# Altium schematic sheet Nano pi.SchDoc
size A3; SheetNumber: 3; SheetTotal: 6
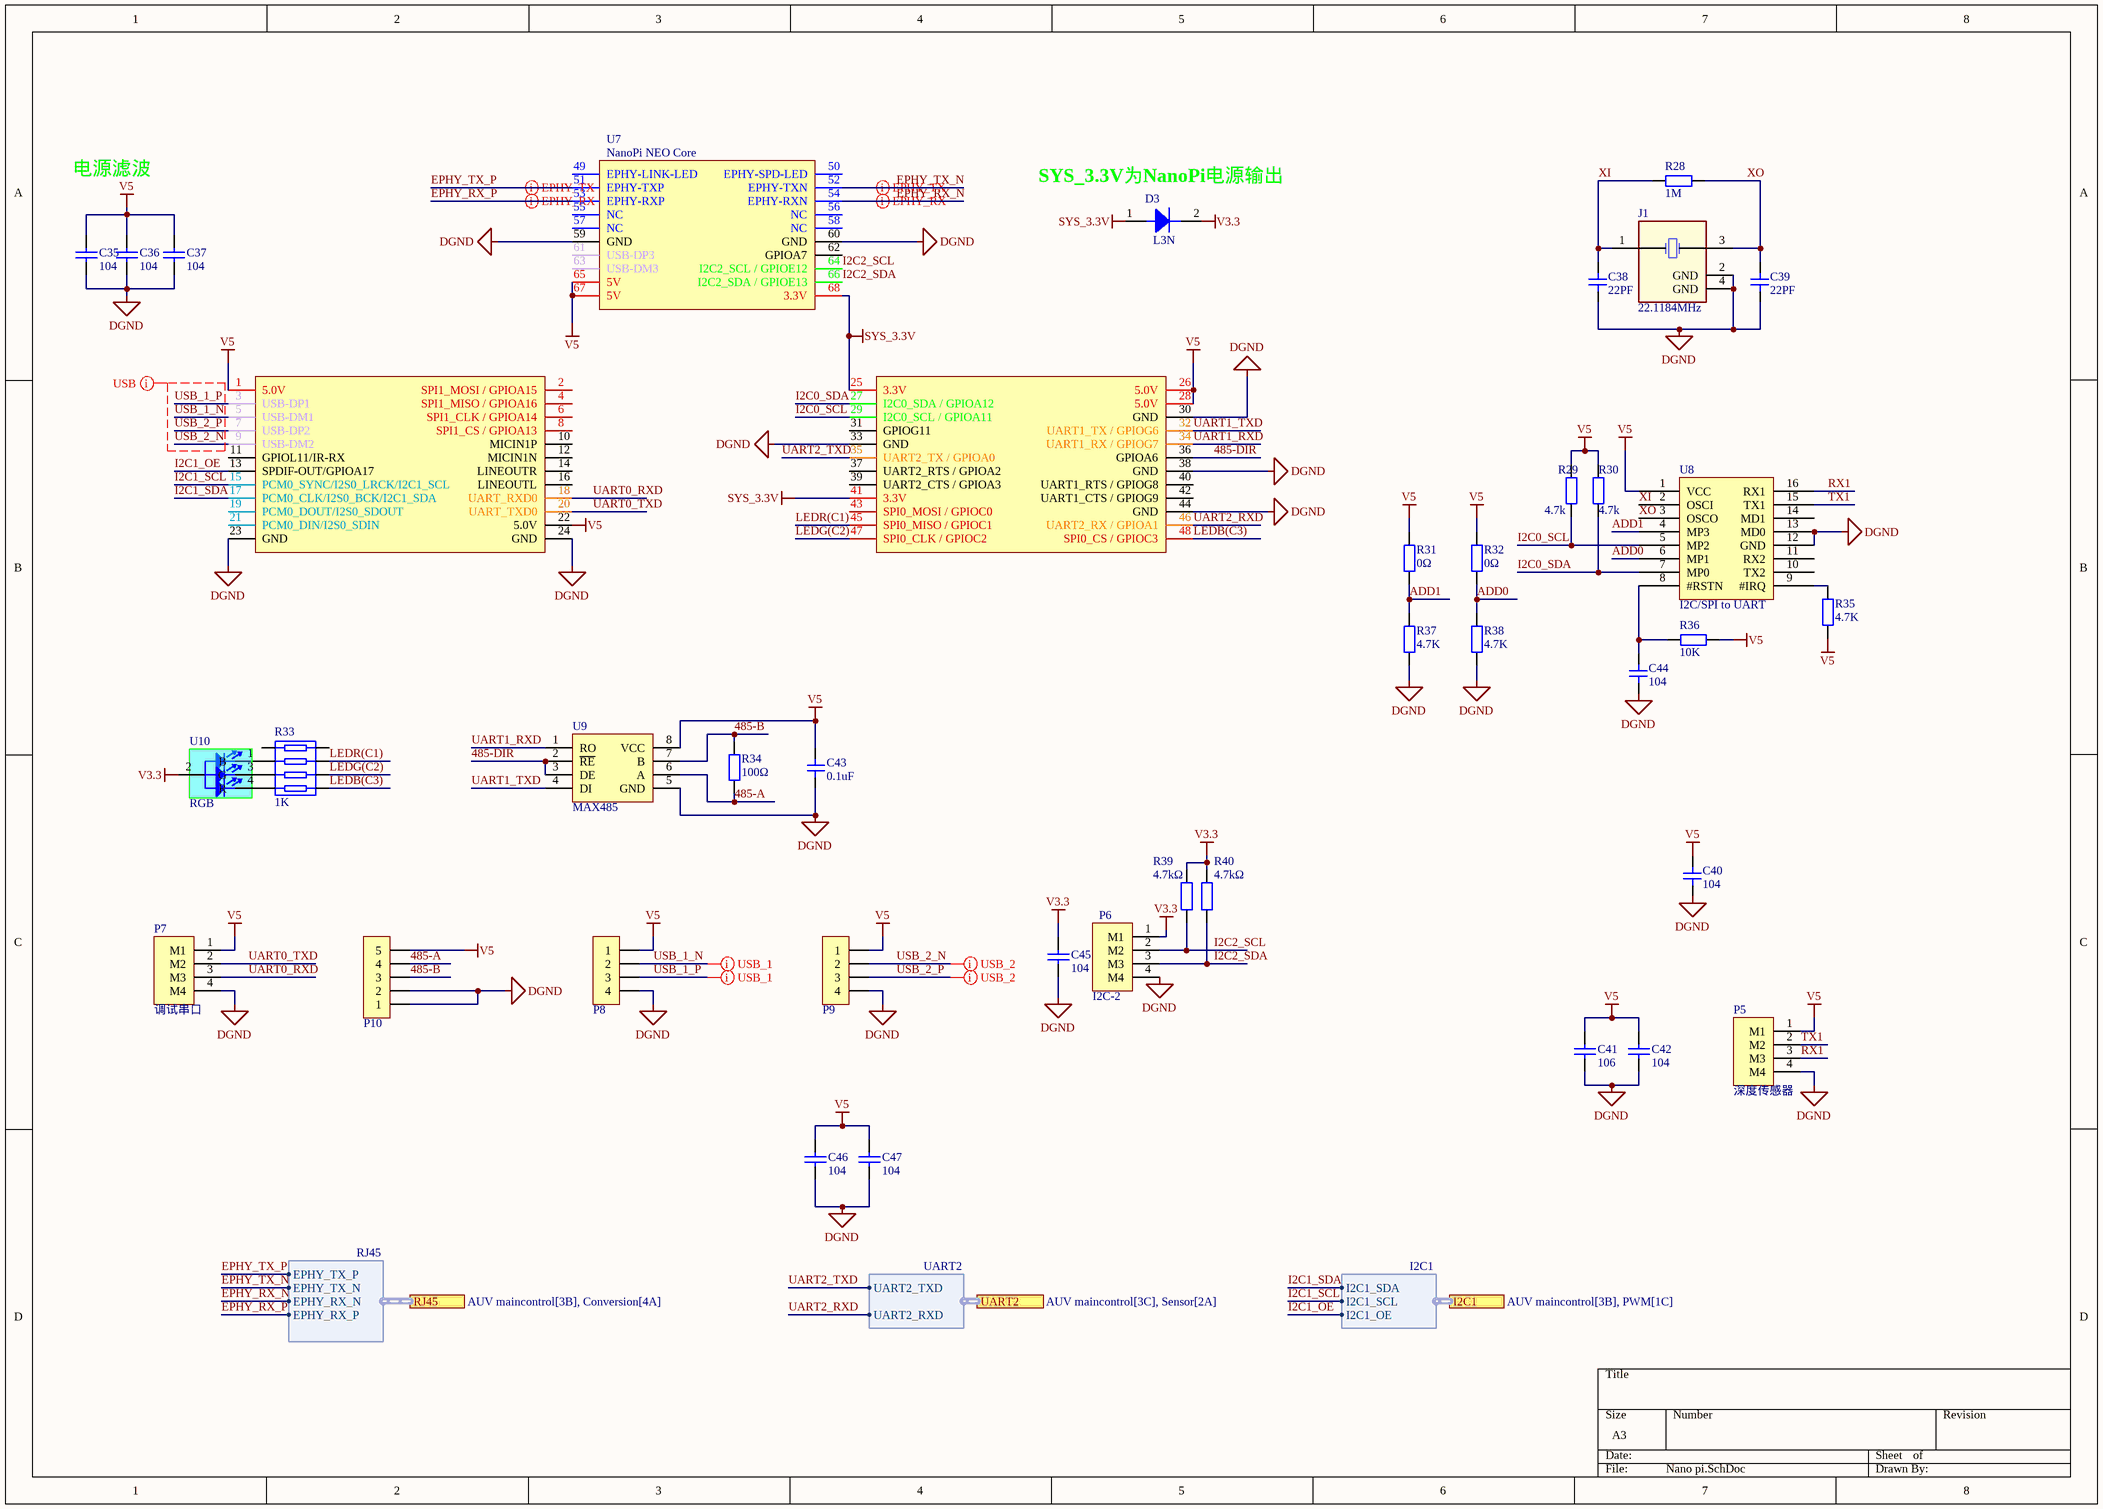
[diagram p0: Nano pi.SchDoc]

## Parts
C35  104  [0603_C]
C36  104  [0603_C]
C37  104  [0603_C]
C38  22PF  [0603_C]
C39  22PF  [0603_C]
C40  104  [0603_C]
C41  106  [0603_C]
C42  104  [0603_C]
C43  0.1uF  [0603_C]
C44  104  [0603_C]
C45  104  [0603_C]
C46  104  [0603_C]
C47  104  [0603_C]
D3  L3N  [SOD-123]
J1  22.1184MHz  [SMD-3225_4P]
P5  深度传感器  [MX1.25S-4P]
P6  I2C-2  [MX1.25S-4P]
P7  调试串口  [MX1.25S-4P]
P8  HDR-1X4  [PH2.0-LS-4P]  (value not drawn)
P9  HDR-1X4  [PH2.0-LS-4P]  (value not drawn)
P10  HDR-1X5  [PH2.0-LS-5P]  (value not drawn)
R28  1M  [0603R]
R29  4.7k  [0603R]
R30  4.7k  [0603R]
R31  0Ω  [0603R]
R32  0Ω  [0603R]
R33  1K  [res-4]
R34  100Ω  [0603R]
R35  4.7K  [0603R]
R36  10K  [0603R]
R37  4.7K  [0603R]
R38  4.7K  [0603R]
R39  4.7kΩ  [0603_R]
R40  4.7kΩ  [0603_R]
U7  NanoPi NEO Core  [NanoPi NEO Core(无引脚名)]
U8  I2C/SPI to UART  [SOP65P780X195-16N]
U9  MAX485  [SOP-8]
U10  RGB  [RGB-3528]

## Ports
I2C1 (harness I2C1, see AUV maincontrol[3B], PWM[1C]), RJ45 (harness RJ45, see AUV maincontrol[3B], Conversion[4A]), UART2 (harness UART2, see AUV maincontrol[3C], Sensor[2A])

## Harnesses
RJ45: EPHY_TX_P, EPHY_TX_N, EPHY_RX_N, EPHY_RX_P
UART2: UART2_TXD, UART2_RXD
I2C1: I2C1_SDA, I2C1_SCL, I2C1_OE

## Nets
DGND: C35.1 C36.1 C37.1 C38.2 C39.2 C40.2 C41.1 C42.1 C43.1 C44.2 C45.1 C46.1 C47.1 J1.2(GND) J1.4(GND) P5.4(M4) P6.4(M4) P7.4(M4) P8.4 P9.4 P10.1 P10.2 R37.1 R38.1 U7.23(GND) U7.24(GND) U7.30(GND) U7.33(GND) U7.38(GND) U7.44(GND) U7.59(GND) U7.60(GND) U8.12(GND) U8.13(MD0) U9.5(GND)
SYS_3.3V: D3.1 U7.25(3.3V) U7.41(3.3V) U7.68(3.3V)
V3.3: C45.2 D3.2 P6.1(M1) R39.2 R40.2 U10.2
V5: C35.2 C36.2 C37.2 C40.1 C41.2 C42.2 C43.2 C46.2 C47.2 P5.1(M1) P7.1(M1) P8.1 P9.1 P10.5 R29.2 R30.2 R31.2 R32.2 R35.1 R36.2 U7.1(5.0V) U7.22(5.0V) U7.26(5.0V) U7.28(5.0V) U7.65(5V) U7.67(5V) U8.1(VCC) U9.8(VCC)
485-A: P10.4 R34.1 U9.6(A)
485-B: P10.3 R34.2 U9.7(B)
485-DIR: U7.36(GPIOA6) U9.2(~{RE}) U9.3(DE)
ADD0: R32.1 R38.2 U8.6(MP1)
ADD1: R31.1 R37.2 U8.4(MP3)
EPHY_RX_N: U7.54(EPHY-RXN) ; port RJ45.EPHY_RX_N
EPHY_RX_P: U7.53(EPHY-RXP) ; port RJ45.EPHY_RX_P
EPHY_TX_N: U7.52(EPHY-TXN) ; port RJ45.EPHY_TX_N
EPHY_TX_P: U7.51(EPHY-TXP) ; port RJ45.EPHY_TX_P
I2C0_SCL: R29.1 U7.29(I2C0_SCL_/_GPIOA11) U8.5(MP2)
I2C0_SDA: R30.1 U7.27(I2C0_SDA_/_GPIOA12) U8.7(MP0)
I2C1_OE: U7.13(SPDIF-OUT/GPIOA17) ; port I2C1.I2C1_OE
I2C1_SCL: U7.15(PCM0_SYNC/I2S0_LRCK/I2C1_SCL) ; port I2C1.I2C1_SCL
I2C1_SDA: U7.17(PCM0_CLK/I2S0_BCK/I2C1_SDA) ; port I2C1.I2C1_SDA
I2C2_SCL: P6.2(M2) R39.1 U7.64(I2C2_SCL_/_GPIOE12)
I2C2_SDA: P6.3(M3) R40.1 U7.66(I2C2_SDA_/_GPIOE13)
LEDB(C3): R33.5 U7.48(SPI0_CS_/_GPIOC3)
LEDG(C2): R33.6 U7.47(SPI0_CLK_/_GPIOC2)
LEDR(C1): R33.7 U7.45(SPI0_MISO_/_GPIOC1)
RX1: P5.3(M3) U8.16(RX1)
TX1: P5.2(M2) U8.15(TX1)
UART0_RXD: P7.3(M3) U7.18(UART_RXD0)
UART0_TXD: P7.2(M2) U7.20(UART_TXD0)
UART1_RXD: U7.34(UART1_RX_/_GPIOG7) U9.1(RO)
UART1_TXD: U7.32(UART1_TX_/_GPIOG6) U9.4(DI)
UART2_RXD: U7.46(UART2_RX_/_GPIOA1) ; port UART2.UART2_RXD
UART2_TXD: U7.35(UART2_TX_/_GPIOA0) ; port UART2.UART2_TXD
USB_1_N: P8.2 U7.5(USB-DM1)
USB_1_P: P8.3 U7.3(USB-DP1)
USB_2_N: P9.2 U7.9(USB-DM2)
USB_2_P: P9.3 U7.7(USB-DP2)
XI: C38.1 J1.1(OSC1) R28.2 U8.2(OSCI)
XO: C39.1 J1.3(OSC2) R28.1 U8.3(OSCO)
NetC44_1: C44.1 R36.1 U8.8(#RSTN)
NetR33_2: R33.2 U10.1(B)
NetR33_3: R33.3 U10.3(G)
NetR33_4: R33.4 U10.4(R)
NetR35_2: R35.2 U8.9(#IRQ)

Not connected (* = marked no-connect by the designer): R33 1 8; U7 2(SPI1_MOSI_/_GPIOA15) 4(SPI1_MISO_/_GPIOA16) 6(SPI1_CLK_/_GPIOA14) 8(SPI1_CS_/_GPIOA13) 10(MICIN1P) 11(GPIOL11/IR-RX) 12(MICIN1N) 14(LINEOUTR) 16(LINEOUTL) 19(PCM0_DOUT/I2S0_SDOUT) 21(PCM0_DIN/I2S0_SDIN) 31(GPIOG11) 37(UART2_RTS_/_GPIOA2) 39(UART2_CTS_/_GPIOA3) 40(UART1_RTS_/_GPIOG8) 42(UART1_CTS_/_GPIOG9) 43(SPI0_MOSI_/_GPIOC0) 49(EPHY-LINK-LED) 50(EPHY-SPD-LED) 55(NC) 56(NC) 57(NC) 58(NC) 61(USB-DP3) 62(GPIOA7) 63(USB-DM3); U8 10(TX2) 11(RX2) 14(MD1)

## Layout directives
differential pair: EPHY_RX_N, EPHY_RX_P, EPHY_TX_N, EPHY_TX_P, USB_1_N, USB_1_P, USB_2_N, USB_2_P
net class USB: USB_1_N, USB_1_P, USB_2_N, USB_2_P

## Notes on the sheet
- 电源滤波
- (near U7) SYS_3.3V为NanoPi电源输出

## Library data of the parts
C35-C37 C41 C42 C45-C47 = SMT_Cap: 贴片电容; ComponentLink1Description: 供应商链接; ComponentLink1URL: http://www.szlcsc.com/product/details_29010.html; Package: 0805; Supplier: LC; SuppliersPartNumber: C28260
C38-C40 C43 C44 = Cap1: 无极贴片电容
D3 = Diode: 二极管30V/2A
J1 = Oscillator_SMT_4P
P5-P7 = 接线端子-4PIN: 4PIN
P8 P9 = Header 4: 4P接插件; 封装库来自淘宝卖家  ID：黄晶宝石: 其他店铺购入均为盗版假冒封装库，请立即申请退款; 技术支持，联系售后: 唯一出售店铺网址https://shop463601444.taobao.com
P10 = Header 5: 5P接插件; 封装库来自淘宝卖家  ID：黄晶宝石: 其他店铺购入均为盗版假冒封装库，请立即申请退款; 技术支持，联系售后: 唯一出售店铺网址https://shop463601444.taobao.com
R28-R32 R34-R38 = Res: 电阻
R33 = Res-4: 排阻
R39 R40 = SMT_Res: 贴片电阻; ComponentLink1Description: 供应商链接; ComponentLink1URL: http://www.szlcsc.com/product/details_23980.html; Package: 0603; Supplier: LC; SuppliersPartNumber: C23253
U8 = WK2132-ISSG